# Altium schematic sheet Power.SchDoc
size A4; Author: Author Name; Organization: ORGANIZATION; Address1: ADDRESS 1; Address2: ADDRESS 2; Address3: ADDRESS 3; Address4: ADDRESS 4; Revision: -; SheetNumber: 4; SheetTotal: 6; ENG_APP_DATE: --/--/--; DSN_APP_DATE: --/--/--; CHK_APP_DATE: --/--/--
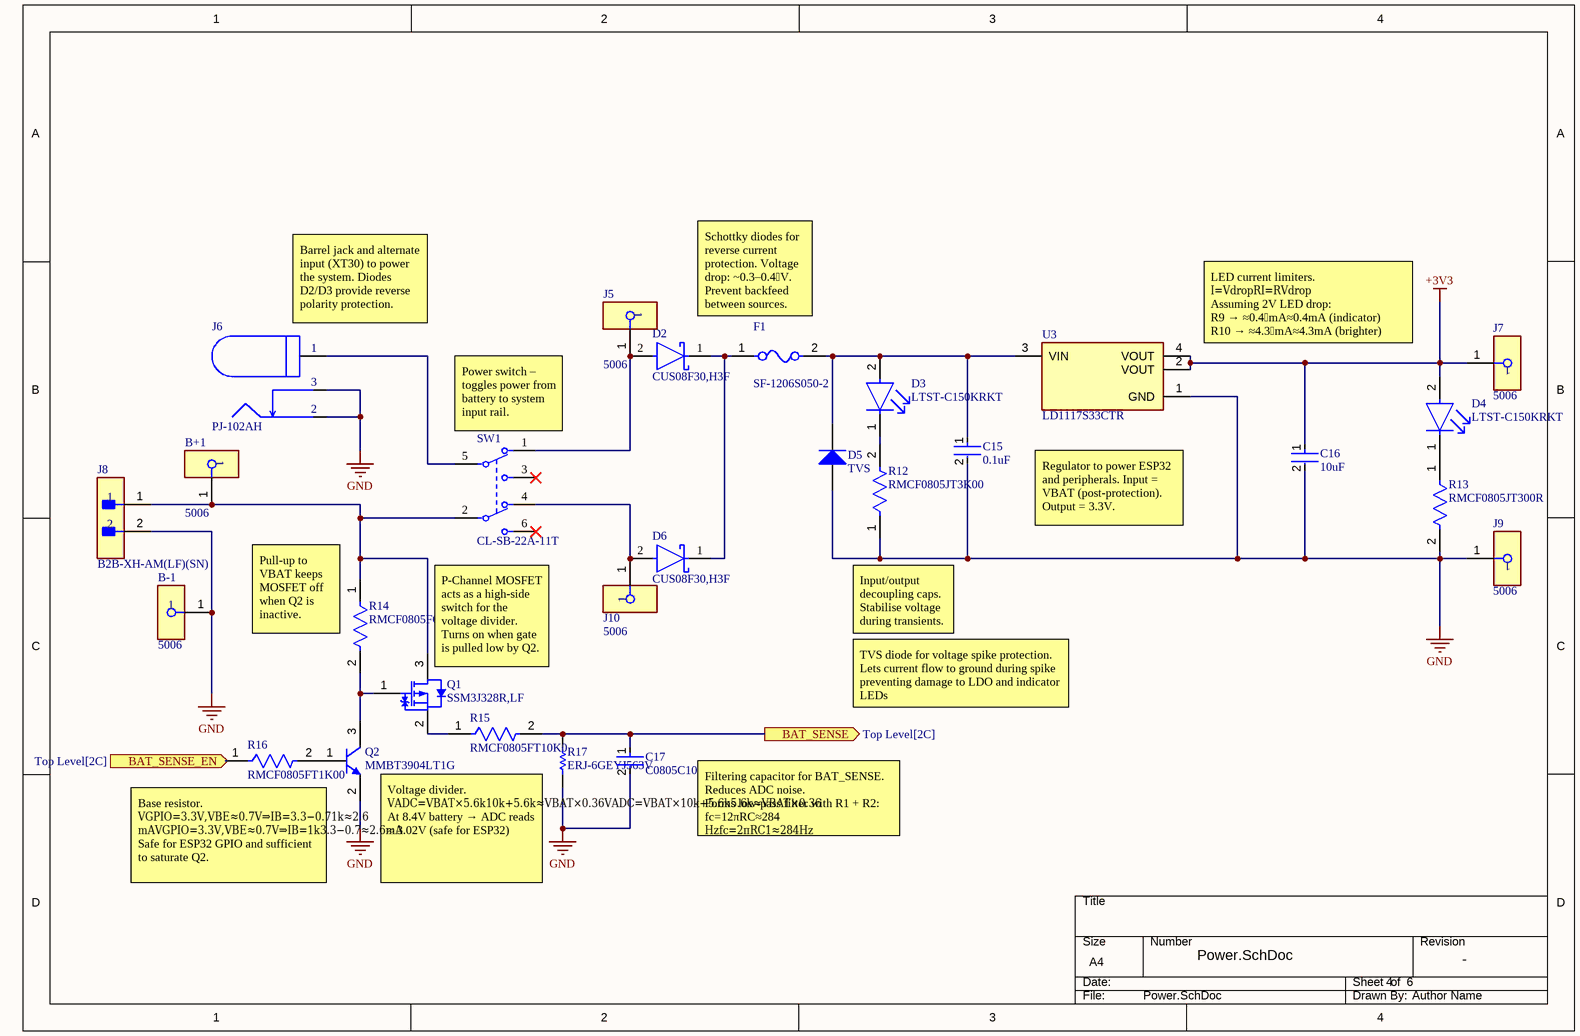
[diagram p0: Power.SchDoc]

## Parts
B+1  5006  [FP-5006-MFG]
B-1  5006  [FP-5006-MFG]
C15  0.1uF  [FP-C0805C-DN-MFG]
C16  10uF  [FP-C0805C106J8RACAUTO-MFG]
C17  C0805C103J5RAC7210  [FP-C0805C-DN-MFG]
D2  CUS08F30,H3F  [FP-USC-MFG]
D3  LTST-C150KRKT  [FP-LTST-C150KRKT-MFG]
D4  LTST-C150KRKT  [FP-LTST-C150KRKT-MFG]
D5  TVS  [VISH-DO-214AC-2_L]
D6  CUS08F30,H3F  [FP-USC-MFG]
F1  SF-1206S050-2  [FP-SF-1206S-MFG]
J5  5006  [FP-5006-MFG]
J6  PJ-102AH  [CON Barrel PJ-102AH]
J7  5006  [FP-5006-MFG]
J8  B2B-XH-AM(LF)(SN)  [FP-B2B-XH-AM_LF_SN-MFG]
J9  5006  [FP-5006-MFG]
J10  5006  [FP-5006-MFG]
Q1  SSM3J328R,LF  [TOSH-SOT-23F_V]
Q2  MMBT3904LT1G  [ONSC-SOT-23-3-318-08_V]
R12  RMCF0805JT3K00  [FP-RMCF0805-IPC_C]
R13  RMCF0805JT300R  [FP-RMCF0805-IPC_B]
R14  RMCF0805FG100K  [FP-RMCF0805-IPC_C]
R15  RMCF0805FT10K0  [FP-RMCF0805-MFG]
R16  RMCF0805FT1K00  [FP-RMCF0805-IPC_C]
R17  ERJ-6GEYJ563V  [RESC2013X70X40ML20T20]
SW1  CL-SB-22A-11T  [FP-CL-SB-22A-11T-MFG]
U3  LD1117S33CTR  [FP-SOT-223-0046067_14-MFG]

## Ports
BAT_SENSE (out, see Top Level[2C]), BAT_SENSE_EN (in, see Top Level[2C])

## Nets
+3V3: C16.1 D4.2(A) J7.1 U3.2(VOUT) U3.4(VOUT)
GND: B-1.1 C15.2 C16.2 C17.2 D5.2(A) J6.2 J6.3 J8.2 J9.1 Q2.2(E) R12.1 R13.2 R17.1 U3.1(GND)
BAT_SENSE: C17.1 R15.2 R17.2 ; port BAT_SENSE
BAT_SENSE_EN: R16.1 ; port BAT_SENSE_EN
NetB+1_1: B+1.1 J8.1 Q1.3(D) R14.1 SW1.2
NetC15_1: C15.1 D3.2(A) D5.1(K) F1.2 U3.3(VIN)
NetD2_1: D2.1(C) D6.1(C) F1.1
NetD2_2: D2.2(A) J5.1 SW1.1
NetD3_1: D3.1(C) R12.2
NetD4_1: D4.1(C) R13.1
NetD6_2: D6.2(A) J10.1 SW1.4
NetJ6_1: J6.1 SW1.5
NetQ1_1: Q1.1(G) Q2.3(C) R14.2
NetQ1_2: Q1.2(S) R15.1
NetQ2_1: Q2.1(B) R16.2

Not connected (* = marked no-connect by the designer): SW1 3* 6*

## Notes on the sheet
- Schottky diodes for reverse current protection. Voltage drop: ~0.3–0.4 V. Prevent backfeed between sources.
- (near J6) Barrel jack and alternate input (XT30) to power the system. Diodes D2/D3 provide reverse polarity protection.
- LED current limiters.
  I=VdropRI=RVdrop​​
  Assuming 2V LED drop:
  R9 → ≈0.4 mA≈0.4mA (indicator)
  R10 → ≈4.3 mA≈4.3mA (brighter)
- (near SW1) Power switch – toggles power from battery to system input rail.
- Regulator to power ESP32 and peripherals. Input = VBAT (post-protection). Output = 3.3V.
- (near R14) Pull-up to VBAT keeps MOSFET off when Q2 is inactive.
- Input/output decoupling caps. Stabilise voltage during transients.
- (near Q1) P-Channel MOSFET acts as a high-side switch for the voltage divider. Turns on when gate is pulled low by Q2.
- TVS diode for voltage spike protection. Lets current flow to ground during spike preventing damage to LDO and indicator LEDs
- Filtering capacitor for BAT_SENSE. Reduces ADC noise.
  Forms low-pass filter with R1 + R2:
  fc=12πRC≈284 Hzfc​=2πRC1​≈284Hz
- Base resistor.
  VGPIO=3.3V,VBE≈0.7V⇒IB=3.3−0.71k≈2.6 mAVGPIO​=3.3V,VBE​≈0.7V⇒IB​=1k3.3−0.7​≈2.6mA
  Safe for ESP32 GPIO and sufficient to saturate Q2.
- Voltage divider.
  VADC=VBAT×5.6k10k+5.6k≈VBAT×0.36VADC​=VBAT​×10k+5.6k5.6k​≈VBAT​×0.36
  At 8.4V battery → ADC reads ≈ 3.02V (safe for ESP32)
- DWG. NO.
- REV.
- SHT.
- THIS DOCUMENT AND THE DATA DISCLOSED HEREIN OR HEREWITH IS THE PROPERTY OF ALTIUM LIMITED AND MAY BE FREELY DISTRIBUTED IN WHOLE. NO RIGHTS ARE RESERVED OR EXPRESS OR IMPLIED WARANTEE GIVEN.
- REVISION
- DESCRIPTION
- DATE
- APPROVED
- ENG:
- APPROVALS
- PROJECT
- DSN:
- CHK:
- REFERENCE DOCUMENTS
- PROJECT REVISION:
- TITLE
- DOCUMENT REVISION:
- DESIGN ITEM:
- BOM:
- FAB DWG:
- PCB DWG:
- ASSY DWG:
- SCALE:
- SIZE
- B
- CAGE CODE
- FILE NAME
- DWG NO.
- SHEET
- OF
- REV

## Library data of the parts
B+1 B-1 J5 J7 J9 J10 = CMP-19636-000022-1: PC TEST POINT COMPACT BLACK; Body Material: Bronze; Inside Diameter: 1.78mm; Number of Ports: 1; Hole Diameter: 1.6mm; Outside Diameter: 3.18mm; Plating: Silver; Contact Plating: Tin; Color: Black; RoHS Compliant: Yes; Flammability Rating: UL94 V-0; Contact Material: Bronze; Material: Nylon; Orientation: Straight; Package Quantity: 100; Housing Color: Black; Length: 8.89mm; Series: THM; Mount: PCB; Height: 0.35inch; Packaging: Bulk; REACH SVHC: No SVHC; Insulation Material: Nylon; Lead Free: Lead Free
C15 = CMP-03020-000950-1: CAP CER 0.1UF 50V X7R 0805; Manufacturer: KEMET; Manufacturer Part Number: C0805C104J5RACTU; Temperature Coefficient: 30ppm/°C; Value: 0.10 μF; Material: Ceramic; Tolerance: 0.05; Voltage Rating: 50 V; Digikey Description: CAP CER 0.1UF 50V X7R 0805; Octopart: https://octopart.com/c0805c104j5ractu-kemet-104634; RoHS: TRUE; Device Class L1: Passive Components; Temperature Characteristic: X7R; Device Class L3: Ceramic Capacitors; Lead Free: Yes; Automotive: No; Category: Cap; Temperature: -55°C to +125°C; Package: C0805C-DN; Temperature Range High: +125°C; Height: 0.88mm; Capacitance: 0.10 μF; Temperature Range Low: -55°C; ComponentLink2Description: Datasheet; ComponentLink2URL: https://content.kemet.com/datasheets/KEM_C1003_C0G_SMD.pdf; Ipc Land Pattern Name: CAPC200125X78; Device Class L2: Capacitors; Mouser Description: Multilayer Ceramic Capacitors MLCC - SMD/SMT 50volts 0.1uF X7R 5%
C16 = CMP-03020-034708-1: CAP CER 10UF 10V X7R 0805; Tolerance: 5%; Mount: Surface Mount; Capacitance: 10uF; Voltage Rating: 10V; Max Operating Temperature: 125°C; Min Operating Temperature: -55°C; Case/Package: 0805; RoHS Compliant: Yes; Packaging: Tape and Reel; Case Code (Imperial): 0805; Case Code (Metric): 2012; Ratings: AEC-Q200
C17 = CMP-2007-01173-3: CAP CER SMD 0805 .01UF X7R 5% 50; Manufacturer: KEMET; Value: 10,000 pF; Temperature Coefficient: 30ppm/°C; Tolerance: 0.05; Voltage Rating: 50 V; Material: Ceramic; Digikey Description: CAP CER SMD 0805 .01UF X7R 5% 50; Temperature Characteristic: X7R; Manufacturer Part Number: C0805C103J5RAC7210; ComponentLink2URL: https://content.kemet.com/datasheets/KEM_C1003_C0G_SMD.pdf; ComponentLink2Description: Datasheet; Temperature Range High: +125°C; Package: C0805C-DN; Category: Cap; RoHS: TRUE; Device Class L1: Passive Components; Ipc Land Pattern Name: CAPC200125X78; Mouser Description: Cap Ceramic 0.01uF 50V X7R 5% Pad SMD 0805 125C T/R; Temperature: -55°C to +125°C; Octopart: https://octopart.com/c0805c103j5rac7210-kemet-3921106; Capacitance: 10,000 pF; Height: 0.88mm; Temperature Range Low: -55°C; Device Class L3: Ceramic Capacitors; Device Class L2: Capacitors; Lead Free: Yes; Automotive: No
D2 D6 = CMP-00375-53632863-1: CUS08F30,H3F Rectifier Diode, Schottky, 1 Phase, 1 Element, 0.8A, 30V V(RRM), Silicon; Max Forward Surge Current (Ifsm): 5A; Capacitance: 170pF; Average Rectified Current: 800mA; Peak Reverse Current: 50µA; Element Configuration: Single; Max Junction Temperature (Tj): 125°C; Mount: Surface Mount; Contact Plating: Silver, Tin; NexarPartId: 53632863; RoHS: Compliant; Packaging: Digi-Reel®; Peak Non-Repetitive Surge Current: 5A; Schedule B: 8541100080, 8541100080; Max Reverse Voltage (DC): 30V; Reverse Voltage: 30V; Min Operating Temperature: -55°C; Forward Current: 800mA; Number of Pins: 2; Max Operating Temperature: 125°C; Height: 1.15mm; Max Repetitive Reverse Voltage (Vrrm): 30V; Case/Package: SOD
D3 D4 = CMP-2000-06617-2: LED RED CLEAR 1206 SMD; Wavelength: 639nm; Power Dissipation: 62.5mW; Luminous Intensity: 54mcd; Test Current: 20mA; Forward Current: 30mA; Reverse Voltage: 5V; Viewing Angle: 130°; Number of Elements: 1; Lens Style: Diffused; Power Rating: 75mW; Lens Color: Colorless; Forward Voltage: 2V; Dominant Wavelength: 631nm; Depth: 1.6mm; Mount: Surface Mount; Packaging: Tape and Reel; Case Code (Metric): 3216; Lens Transparency: Clear; Illumination Color: Red; Radiation Hardening: No; Min Operating Temperature: -30°C; Height: 1.1mm; Case Code (Imperial): 1206; Number of Pins: 2; Length: 3.2mm; Lead Free: Lead Free; Color: Red; Width: 1.6mm; Number of LEDs: 1; Max Operating Temperature: 85°C; Case/Package: 1206; Package Quantity: 1
D5 = CMP-0548-00238-2: Transient Voltage Suppressor, 6.40 to 231 V, 10 V Stand-off Voltage, Uni-Directional, -55 to 155 degC, 2-pin DO-214AC, Pb-Free, Tape and Reel; PartNumber: SMAJ10A-E3/61; Manufacturer: Vishay Semiconductor; VBR Uni-Directional (V): 6.4 to 231; ID (uA): 1; IFSM: 40 A; VWM (V): 10; PPPM (W): 400, 300; PackageReference: DO-214AC-2; ComponentLink2URL: http://www.vishay.com/docs/88390/smaj50a.pdf; Operating Junction and Storage Temperature Range: -55 to 150 degC; DatasheetVersion: 12/8/2013; ComponentLink3URL: http://www.vishay.com/docs/88390/smaj50a.pdf; ComponentLink1Description: Manufacturer URL; ComponentLink1URL: http://www.vishay.com/; PackageDescription: 2-Pin DO-214AC (SMA), Body 4.245 x 2.665 mm; ComponentLink3Description: Package Specification; RoHS: TRUE; Packing: Tape and Reel; Mounting Technology: Surface Mount; ComponentLink2Description: Datasheet
F1 = CMP-07399-000002-1: FUSE BOARD MNT 500MA 63VDC 1206; Manufacturer: Bourns; Fuse Blow Speed: Slow; Voltage Rating: 63V; Value: 596mΩ; Fuse Interrupt Dc Current: 50A; Fuse I2T: 0.03A2Sec; Fuse Current: 0.5A; Digikey Description: FUSE BOARD MNT 500MA 63VDC 1206; ComponentLink2Description: Datasheet; Temperature: -20°C to +105°C; Category: Fuse; Device Class L2: Fuses; Device Class L3: unset; ComponentLink2URL: https://www.bourns.com/docs/product-datasheets/sf-1206s.pdf?sfvrsn=e6b376e3_33; RoHS: TRUE; Package: SF-1206S; Height: 0.7mm; Octopart: https://octopart.com/sf-1206s050-2-bourns-8398336; Manufacturer Part Number: SF-1206S050-2; Ipc Land Pattern Name: CAPC310155X60; Temperature Range Low: -20°C; Lead Free: Yes; Max Fuse Dc Voltage: 63V; Automotive: No; Device Class L1: Circuit Protection; Mouser Description: Fuse Chip Slow Blow Acting 0.5A 63V SMD Solder Pad 1206 T/R UL; Resistance: 596mΩ; Temperature Range High: +105°C
J6 = CON PWR PJ-102AH: Power Barrel Con, 2.0mm ID, 5.5mm OD, 5A; Manufacturer: CUI Devices; Manufacturer Code: PJ-102AH; Digikey Order: CP-102AH-ND; Supplier 1: Arrow Electronics; Supplier Part Number 1: PJ-102AH
J8 = CMP-17439-000037-1: CONN HEADER VERT 2POS 2.5MM; Max Voltage Rating (AC): 250V; Connector Type: Male Pin; Contact Resistance: 20mR; Max Current Rating: 3A; Number of Positions: 2; Series: XH; Contact Material: Brass; Mount: Through Hole; Housing Material: Polyamide; Contact Plating: Tin; Termination: Solder; Max Operating Temperature: 85°C; Depth: 5.75mm; Packaging: Bulk; Min Operating Temperature: -25°C; Contact Type: Male Pin; Color: Green; Pitch: 2.5mm; Length: 7.4mm; Lead Free: Lead Free; Number of Rows: 1; Fastening Type: Detent; Housing Color: White; Orientation: Straight
Q1 = CMP-2100-03686-1: TOSHIBA Field-Effect Transistor Silicon P-Channel MOS Type (U-MOS VI), 20 V, -55 to 125 degC, 3-Pin SOTFL, RoHS, Tape and Reel; Gate to Source Voltage (Vgs): 8V; Drain to Source Breakdown Voltage: -20V; Turn-Off Delay Time: 107ns; Continuous Drain Current (ID): 6A; Rds On Max: 29.8mOhm; Number of Elements: 1; Turn-On Delay Time: 32ns; Drain to Source Resistance: 47.4mOhm; Drain to Source Voltage (Vdss): 20V; Power Dissipation: 2W; Element Configuration: Single; Max Power Dissipation: 1W; Input Capacitance: 840pF; Manufacturer URL: http://www.toshiba.com/; Number of Pins: 3; Number of Channels: 1; Max Operating Temperature: 150degC; Min Operating Temperature: -55degC; Manufacturer: Toshiba; Mount: SurfaceMount; Package Description: 3-Pin Small Outline Transistor, Flat Lead, Body 2.9 x 1.8 mm, Pitch 0.95 mm; Radiation Hardening: No; Package Quantity: 3000; Package Reference: SOT-23F; RoHSCompliant: true; Package URL: https://toshiba.semicon-storage.com/ap-en/design-support/package/detail.SOT-23F.html; Packaging: TapeandReel; Datasheet Version: 41699.0; Case/Package: SOT-23-3; Datasheet URL: https://toshiba.semicon-storage.com/info/docget.jsp?did=2429&prodName=SSM3J328R
Q2 = CMP-1048-00631-1: General Purpose Transistor, NPN Silicon, 3-Pin SOT-23, Pb-Free, Tape and Reel; Manufacturer: On Semiconductor; IC Continuous (A): 0.2; fT Min (MHz): 300; ComponentLink2Description: Datasheet; Polarity: NPN; PackageDescription: 3-Pin Small Outline Transistor, Body 2.92 x 1.3 mm, Pitch 0.95 mm; ComponentLink2URL: http://www.onsemi.cn/pub_link/Collateral/MMBT3904LT1-D.PDF; DatasheetVersion: Rev. 12; Mounting Technology: Surface Mount; PartNumber: MMBT3904LT1G; ComponentLink1URL: http://www.onsemi.com/; ComponentLink3Description: Package Specification; ComponentLink1Description: Manufacturer URL; PackageVersion: Rev. AP, 11/2009; PackageReference: SOT-23-3-318-08; Packing: Tape and Reel; ComponentLink3URL: http://www.onsemi.cn/pub_link/Collateral/318-08.PDF; RoHS: TRUE
R12 = CMP-26527-006913-1: 3kΩ ±5% 0.125W 0805 Thick Film Chip Resistor AEC-Q200 compliant; Max Power Dissipation: 125mW; Resistance: 3kR; Temperature Coefficient: 200ppm/°C; Military Standard: Not; Case Code (Metric): 2012; Tolerance: 5%; Depth: 1.25mm; Case Code (Imperial): 0805; Contact Plating: Tin; Packaging: Tape and Reel; Height: 0.026inch; RoHS Compliant: Yes; Number of Terminations: 2; Case/Package: 0805; Mount: Surface Mount; Resistor Type: Thick Film; Min Operating Temperature: -55°C; Series: RMCF; Features: Automotive AEC-Q200; Max Operating Temperature: 155°C; Radiation Hardening: No; Width: 0.049inch; Length: 0.079inch; Construction: Rectangular
R13 = CMP-26527-003681-1: 300Ω ±5% 0.125W 0805 Thick Film Chip Resistor AEC-Q200 compliant; Temperature Coefficient: 200ppm/°C; Resistance: 300R; Max Power Dissipation: 125mW; Tolerance: 5%; Features: Automotive AEC-Q200; Radiation Hardening: No; Case/Package: 0805; Mount: Surface Mount; Number of Terminations: 2; RoHS Compliant: Yes; Resistor Type: Thick Film; Length: 0.079inch; Height: 0.026inch; Width: 0.049inch; Package Quantity: 5000; Series: RMCF; Case Code (Metric): 2012; Max Operating Temperature: 155°C; Packaging: Tape and Reel; Contact Plating: Tin; Case Code (Imperial): 0805; Min Operating Temperature: -55°C
R14 = CMP-26527-003818-1: 100kΩ ±1% 0.125W 0805 Thick Film Chip Resistor AEC-Q200 compliant; Temperature Coefficient: 100ppm/°C; Max Power Dissipation: 125mW; Resistance: 100kR; Case Code (Metric): 2012; Width: 0.049inch; Min Operating Temperature: -55°C; Features: Automotive AEC-Q200; Contact Plating: Tin; Radiation Hardening: No; Construction: Rectangular; RoHS Compliant: Yes; Package Quantity: 10000; Resistor Type: Thick Film; Military Standard: Not; Series: RMCF; Number of Terminations: 2; Height: 0.026inch; Max Operating Temperature: 155°C; Case/Package: 0805; Case Code (Imperial): 0805; Tolerance: 1%; Packaging: Tape and Reel; Depth: 1.25mm; Mount: Surface Mount; Length: 0.079inch
R15 = CMP-26527-000121-1: RES 10K OHM 1% 1/8W 0805; Power Rating: 125mW; Resistance: 10kR; Temperature Coefficient: 100ppm/°C; Depth: 1.25mm; Construction: Rectangular; Packaging: Tape and Reel; Tolerance: 1%; Lead Free: Lead Free; Case/Package: 0805; RoHS Compliant: Yes; Series: RMCF; Width: 0.049inch; Max Power Dissipation: 125mW; Contact Plating: Tin; Height: 0.026inch; Mount: Surface Mount; Resistor Type: Thick Film; Size Code: 0805; Length: 2mm; Max Operating Temperature: 155°C; Features: Automotive AEC-Q200; Radiation Hardening: No; Case Code (Imperial): 0805; Min Operating Temperature: -55°C; Case Code (Metric): 2012; Number of Terminations: 2; Military Standard: Not
R16 = CMP-26527-002331-1: 1kΩ ±1% 0.125W 0805 Thick Film Chip Resistor AEC-Q200 compliant; Resistance: 1kR; Max Power Dissipation: 125mW; Temperature Coefficient: 100ppm/°C; Contact Plating: Tin; Case Code (Imperial): 0805; Radiation Hardening: No; Case/Package: 0805; Min Operating Temperature: -55°C; Construction: Rectangular; Tolerance: 1%; Length: 2mm; Features: Automotive AEC-Q200; Height: 0.026inch; Mount: Surface Mount; Series: RMCF; Number of Terminations: 2; Width: 0.049inch; Packaging: Tape and Reel; Size Code: 0805; Lead Free: Lead Free; Depth: 1.25mm; Power Rating: 125mW; Resistor Type: Thick Film; Case Code (Metric): 2012; Military Standard: Not; Max Operating Temperature: 155°C; RoHS Compliant: Yes
R17 = CMP-2001-00434-1: Manufacturer: Panasonic; Part Number: ERJ-6GEYJ563V
SW1 = CMP-71745-000011-1: SWITCH SLIDE DPDT 200MA 12V; Operating Force: 153gf; Actuator Material: Nylon; Electrical Life: 10000Cycles; Switch Travel: 2mm; Actuator Type: Standard; Switch Function: On-On; Contact Style: Non-Shorting; Current Rating: 200mA; Throw Configuration: DPDT; Voltage Rating (DC): 12V; Packaging: Cut Tape; Mount: Surface Mount; Contact Material: Copper; Min Operating Temperature: -40°C; Contact Plating: Silver; Actuator Length: 2mm; Series: CL-SB; Max Operating Temperature: 85°C
U3 = CMP-0244-00307-2: IC REG LINEAR 3.3V 800MA SOT223; Input Bias Current: 5mA; Output Voltage Accuracy: 1%; Dropout Voltage: 1.1V; Power Dissipation: 12W; Polarity: Positive; Min Input Voltage: 5.3V; Quiescent Current: 10mA; Max Output Current: 1.3A; Output Current: 950mA; Number of Regulators: 1; Max Supply Voltage: 15V; Output Type: Fixed; Output Voltage: 3.3V; Number of Terminals: 4; Min Supply Voltage: 3.3V; Termination: SMD/SMT; Mount: Surface Mount; Max Power Dissipation: 12W; Case/Package: SOT-223; Lead Free: Lead Free; Height: 1.8mm; REACH SVHC: No SVHC; Radiation Hardening: No; Width: 3.5mm; Length: 6.5mm; Packaging: Tape and Reel; Max Input Voltage: 15V; Accuracy: 1%; Weight: 0.01lb; Contact Plating: Tin; Max Operating Temperature: 125°C; Number of Pins: 4; Max Output Voltage: 3.3V; Min Operating Temperature: -40°C; Nominal Output Voltage: 3.3V; Package Quantity: 1; Min Output Voltage: 3.3V; Number of Outputs: 1